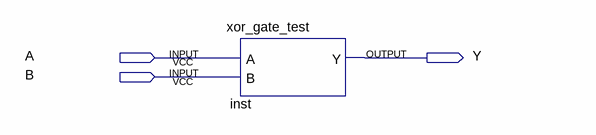
[diagram p0: schematic sheet]
// Quartus schematic xor_gate.bdf as structural Verilog: 1 symbols, 3 pins
module xor_gate (
  input  A,
  input  B,
  output Y
);

  xor_gate_test inst (.A(A), .B(B), .Y(Y));
endmodule
